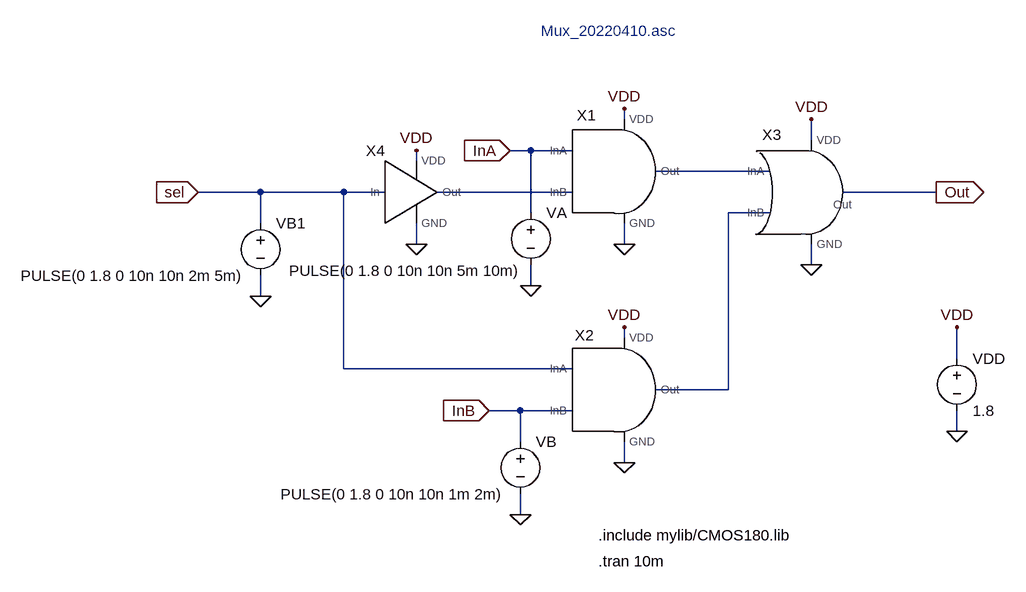
[diagram p0: schematic Mux_20220410.asc]
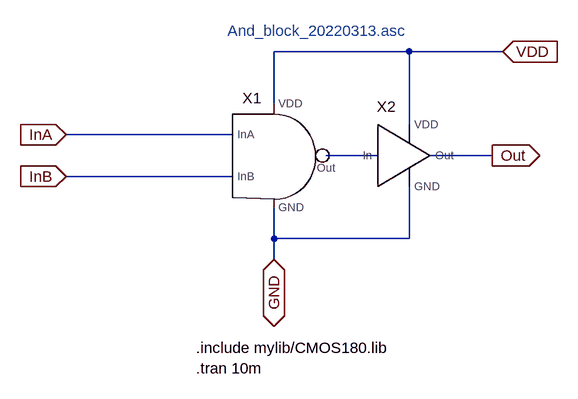
[diagram p1: sub-circuit and_block_20220313.asc]
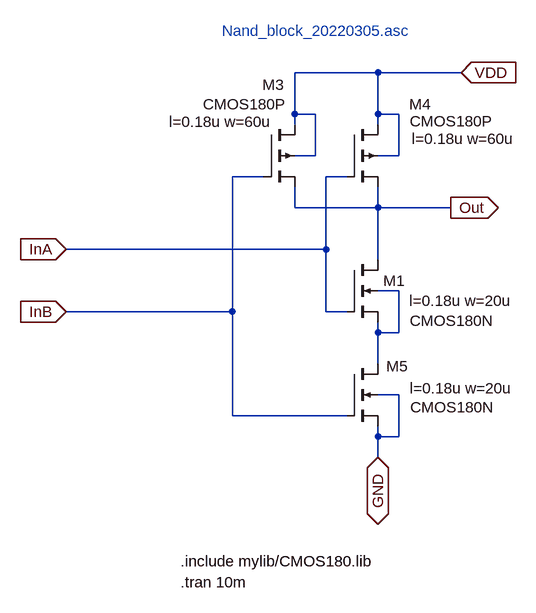
[diagram p2: sub-circuit nand_block_20220305.asc]
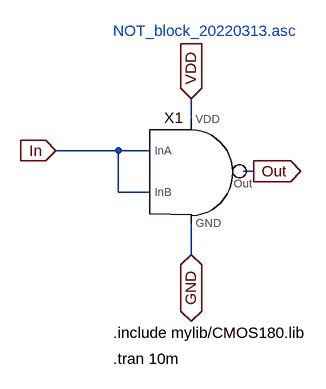
[diagram p3: sub-circuit not_block_20220313.asc]
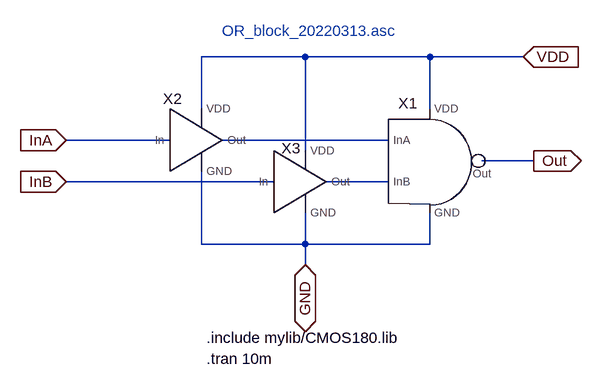
[diagram p4: sub-circuit or_block_20220313.asc]
Mux_20220410.asc, the LTspice schematic file:
Version 4
SHEET 1 1500 696
WIRE 768 -272 768 -288
WIRE 1056 -240 1056 -272
WIRE 624 -224 592 -224
WIRE 688 -224 624 -224
WIRE 448 -208 448 -224
WIRE 992 -192 816 -192
WIRE 208 -160 112 -160
WIRE 336 -160 208 -160
WIRE 400 -160 336 -160
WIRE 688 -160 480 -160
WIRE 1248 -160 1104 -160
WIRE 624 -128 624 -224
WIRE 992 -128 928 -128
WIRE 208 -112 208 -160
WIRE 448 -80 448 -112
WIRE 768 -80 768 -112
WIRE 1056 -48 1056 -80
WIRE 624 -16 624 -48
WIRE 208 0 208 -32
WIRE 768 64 768 48
WIRE 1280 96 1280 48
WIRE 336 112 336 -160
WIRE 688 112 336 112
WIRE 928 144 928 -128
WIRE 928 144 816 144
WIRE 608 176 560 176
WIRE 688 176 608 176
WIRE 1280 208 1280 176
WIRE 608 224 608 176
WIRE 768 256 768 224
WIRE 608 336 608 304
FLAG 1248 -160 Out
IOPIN 1248 -160 Out
FLAG 592 -224 InA
IOPIN 592 -224 In
FLAG 560 176 InB
IOPIN 560 176 In
FLAG 624 -16 0
FLAG 208 0 0
FLAG 1280 208 0
FLAG 1056 -48 0
FLAG 112 -160 sel
IOPIN 112 -160 In
FLAG 448 -80 0
FLAG 768 -80 0
FLAG 768 256 0
FLAG 448 -224 VDD
FLAG 768 -288 VDD
FLAG 1056 -272 VDD
FLAG 768 48 VDD
FLAG 1280 48 VDD
FLAG 608 336 0
SYMBOL voltage 624 -144 R0
WINDOW 3 -372 105 Left 2
WINDOW 123 0 0 Left 0
WINDOW 39 0 0 Left 0
SYMATTR Value PULSE(0 1.8 0 10n 10n 5m 10m)
SYMATTR InstName VA
SYMBOL voltage 608 208 R0
WINDOW 3 -369 97 Left 2
WINDOW 123 0 0 Left 0
WINDOW 39 0 0 Left 0
SYMATTR Value PULSE(0 1.8 0 10n 10n 1m 2m)
SYMATTR InstName VB
SYMBOL voltage 1280 80 R0
WINDOW 123 0 0 Left 0
WINDOW 39 0 0 Left 0
SYMATTR InstName VDD
SYMATTR Value 1.8
SYMBOL And_block_20220313 752 -192 R0
WINDOW 0 -42 -71 Bottom 2
SYMATTR InstName X1
SYMBOL And_block_20220313 752 144 R0
WINDOW 0 -45 -68 Bottom 2
SYMATTR InstName X2
SYMBOL OR_block_20220313 1040 -160 R0
WINDOW 0 -45 -73 Bottom 2
SYMATTR InstName X3
SYMBOL NOT_block_20220313 464 -160 R0
WINDOW 0 -79 -48 Bottom 2
SYMATTR InstName X4
SYMBOL voltage 208 -128 R0
WINDOW 3 -369 97 Left 2
WINDOW 123 0 0 Left 0
WINDOW 39 0 0 Left 0
SYMATTR Value PULSE(0 1.8 0 10n 10n 2m 5m)
SYMATTR InstName VB1
TEXT 728 368 Left 2 !.include mylib/CMOS180.lib
TEXT 640 -408 Left 2 ;Mux_20220410.asc
TEXT 728 408 Left 2 !.tran 10m

and_block_20220313.asc, the sub-circuit schematic file:
Version 4
SHEET 1 1036 680
WIRE 272 -96 64 -96
WIRE 416 -96 272 -96
WIRE 64 -16 64 -96
WIRE 272 16 272 -96
WIRE 0 32 -256 32
WIRE 224 64 144 64
WIRE 400 64 304 64
WIRE 0 96 -256 96
WIRE 64 192 64 144
WIRE 272 192 272 112
WIRE 272 192 64 192
WIRE 64 224 64 192
FLAG 400 64 Out
IOPIN 400 64 Out
FLAG -256 32 InA
IOPIN -256 32 In
FLAG -256 96 InB
IOPIN -256 96 In
FLAG 64 224 GND
IOPIN 64 224 BiDir
FLAG 416 -96 VDD
IOPIN 416 -96 In
SYMBOL Nand_block_20220305 64 80 R0
WINDOW 0 -34 -89 Bottom 2
SYMATTR InstName X1
SYMBOL NOT_block_20220313 288 64 R0
WINDOW 0 -51 -60 Bottom 2
SYMATTR InstName X2
TEXT -56 360 Left 2 !.include mylib/CMOS180.lib
TEXT -8 -128 Left 2 ;And_block_20220313.asc
TEXT -56 392 Left 2 !.tran 10m

nand_block_20220305.asc, the sub-circuit schematic file:
Version 4
SHEET 1 1036 680
WIRE 224 -272 96 -272
WIRE 352 -272 224 -272
WIRE 96 -208 96 -272
WIRE 128 -208 96 -208
WIRE 224 -208 224 -272
WIRE 256 -208 224 -208
WIRE 96 -192 96 -208
WIRE 224 -192 224 -208
WIRE 128 -144 128 -208
WIRE 128 -144 96 -144
WIRE 256 -144 256 -208
WIRE 256 -144 224 -144
WIRE 48 -112 0 -112
WIRE 176 -112 144 -112
WIRE 96 -64 96 -96
WIRE 224 -64 224 -96
WIRE 224 -64 96 -64
WIRE 336 -64 224 -64
WIRE 144 0 144 -112
WIRE 144 0 -256 0
WIRE 224 16 224 -64
WIRE 256 64 224 64
WIRE 0 96 0 -112
WIRE 0 96 -256 96
WIRE 144 96 144 0
WIRE 176 96 144 96
WIRE 224 128 224 112
WIRE 256 128 256 64
WIRE 256 128 224 128
WIRE 224 176 224 128
WIRE 256 224 224 224
WIRE 0 256 0 96
WIRE 176 256 0 256
WIRE 224 288 224 272
WIRE 256 288 256 224
WIRE 256 288 224 288
WIRE 224 320 224 288
FLAG 336 -64 Out
IOPIN 336 -64 Out
FLAG -256 0 InA
IOPIN -256 0 In
FLAG -256 96 InB
IOPIN -256 96 In
FLAG 224 320 GND
IOPIN 224 320 BiDir
FLAG 352 -272 VDD
IOPIN 352 -272 In
SYMBOL nmos4 176 16 R0
WINDOW 123 96 63 Left 2
WINDOW 3 97 94 Left 2
SYMATTR Value2 l=0.18u w=20u
SYMATTR Value CMOS180N
SYMATTR InstName M1
SYMBOL pmos4 48 -192 R0
WINDOW 0 -2 -61 Left 2
WINDOW 3 -93 -31 Left 2
WINDOW 123 -146 -4 Left 2
SYMATTR InstName M3
SYMATTR Value CMOS180P
SYMATTR Value2 l=0.18u w=60u
SYMBOL pmos4 176 -192 R0
WINDOW 0 96 -31 Left 2
WINDOW 3 97 -5 Left 2
WINDOW 123 100 22 Left 2
SYMATTR InstName M4
SYMATTR Value CMOS180P
SYMATTR Value2 l=0.18u w=60u
SYMBOL nmos4 176 176 R0
WINDOW 123 97 38 Left 2
WINDOW 0 61 4 Left 2
WINDOW 3 98 67 Left 2
SYMATTR Value2 l=0.18u w=20u
SYMATTR InstName M5
SYMATTR Value CMOS180N
TEXT -80 480 Left 2 !.include mylib/CMOS180.lib
TEXT -16 -336 Left 2 ;Nand_block_20220305.asc
TEXT -80 512 Left 2 !.tran 10m

not_block_20220313.asc, the sub-circuit schematic file:
Version 4
SHEET 1 1036 680
WIRE 112 -48 112 -80
WIRE 0 0 -96 0
WIRE 48 0 0 0
WIRE 208 32 192 32
WIRE 0 64 0 0
WIRE 48 64 0 64
WIRE 112 160 112 112
FLAG 208 32 Out
IOPIN 208 32 Out
FLAG -96 0 In
IOPIN -96 0 In
FLAG 112 160 GND
IOPIN 112 160 BiDir
FLAG 112 -80 VDD
IOPIN 112 -80 In
SYMBOL Nand_block_20220305 112 48 R0
WINDOW 0 -27 -83 Bottom 2
SYMATTR InstName X1
TEXT -8 280 Left 2 !.include mylib/CMOS180.lib
TEXT -8 -184 Left 2 ;NOT_block_20220313.asc
TEXT -8 320 Left 2 !.tran 10m

or_block_20220313.asc, the sub-circuit schematic file:
Version 4
SHEET 1 1036 680
WIRE 112 -96 -48 -96
WIRE 304 -96 112 -96
WIRE 448 -96 304 -96
WIRE -48 -16 -48 -96
WIRE 304 -16 304 -96
WIRE -96 32 -256 32
WIRE 240 32 -16 32
WIRE 112 48 112 -96
WIRE 464 64 384 64
WIRE 64 96 -256 96
WIRE 240 96 144 96
WIRE -48 192 -48 80
WIRE 112 192 112 144
WIRE 112 192 -48 192
WIRE 304 192 304 144
WIRE 304 192 112 192
WIRE 112 224 112 192
FLAG 464 64 Out
IOPIN 464 64 Out
FLAG -256 32 InA
IOPIN -256 32 In
FLAG -256 96 InB
IOPIN -256 96 In
FLAG 112 224 GND
IOPIN 112 224 BiDir
FLAG 448 -96 VDD
IOPIN 448 -96 In
SYMBOL Nand_block_20220305 304 80 R0
WINDOW 0 -34 -89 Bottom 2
SYMATTR InstName X1
SYMBOL NOT_block_20220313 -32 32 R0
WINDOW 0 -60 -48 Bottom 2
SYMATTR InstName X2
SYMBOL NOT_block_20220313 128 96 R0
WINDOW 0 -38 -36 Bottom 2
SYMATTR InstName X3
TEXT -40 336 Left 2 !.include mylib/CMOS180.lib
TEXT -16 -136 Left 2 ;OR_block_20220313.asc
TEXT -40 368 Left 2 !.tran 10m

The netlist it stands for:
* Mux_20220410.asc
VA InA 0 PULSE(0 1.8 0 10n 10n 5m 10m)
VB InB 0 PULSE(0 1.8 0 10n 10n 1m 2m)
VDD VDD 0 1.8
XX1 InA N002 VDD 0 N001 and_block_20220313
XX2 sel InB VDD 0 N003 and_block_20220313
XX3 N001 N003 VDD 0 Out or_block_20220313
XX4 sel VDD 0 N002 not_block_20220313
VB1 sel 0 PULSE(0 1.8 0 10n 10n 2m 5m)

* block symbol definitions
.subckt and_block_20220313 InA InB VDD GND Out
XX1 InA InB VDD GND N001 nand_block_20220305
XX2 N001 VDD GND Out not_block_20220313
.include mylib/CMOS180.lib
* And_block_20220313.asc
.tran 10m
.ends and_block_20220313

.subckt nand_block_20220305 InA InB VDD GND Out
M1 Out InA N001 N001 CMOS180N l=0.18u w=20u
M3 VDD InB Out VDD CMOS180P l=0.18u w=60u
M4 VDD InA Out VDD CMOS180P l=0.18u w=60u
M5 N001 InB GND GND CMOS180N l=0.18u w=20u
.include mylib/CMOS180.lib
* Nand_block_20220305.asc
.tran 10m
.ends nand_block_20220305

.subckt not_block_20220313 In VDD GND Out
XX1 In In VDD GND Out nand_block_20220305
.include mylib/CMOS180.lib
* NOT_block_20220313.asc
.tran 10m
.ends not_block_20220313

.subckt or_block_20220313 InA InB VDD GND Out
XX1 N001 N002 VDD GND Out nand_block_20220305
XX2 InA VDD GND N001 not_block_20220313
XX3 InB VDD GND N002 not_block_20220313
.include mylib/CMOS180.lib
* OR_block_20220313.asc
.tran 10m
.ends or_block_20220313

.model NMOS NMOS
.model PMOS PMOS
.lib standard.mos
.include mylib/CMOS180.lib
* Mux_20220410.asc
.tran 10m
.backanno
.end